# Altium schematic sheet COBConnector.SchDoc
size C; SheetNumber: 1; SheetTotal: 2
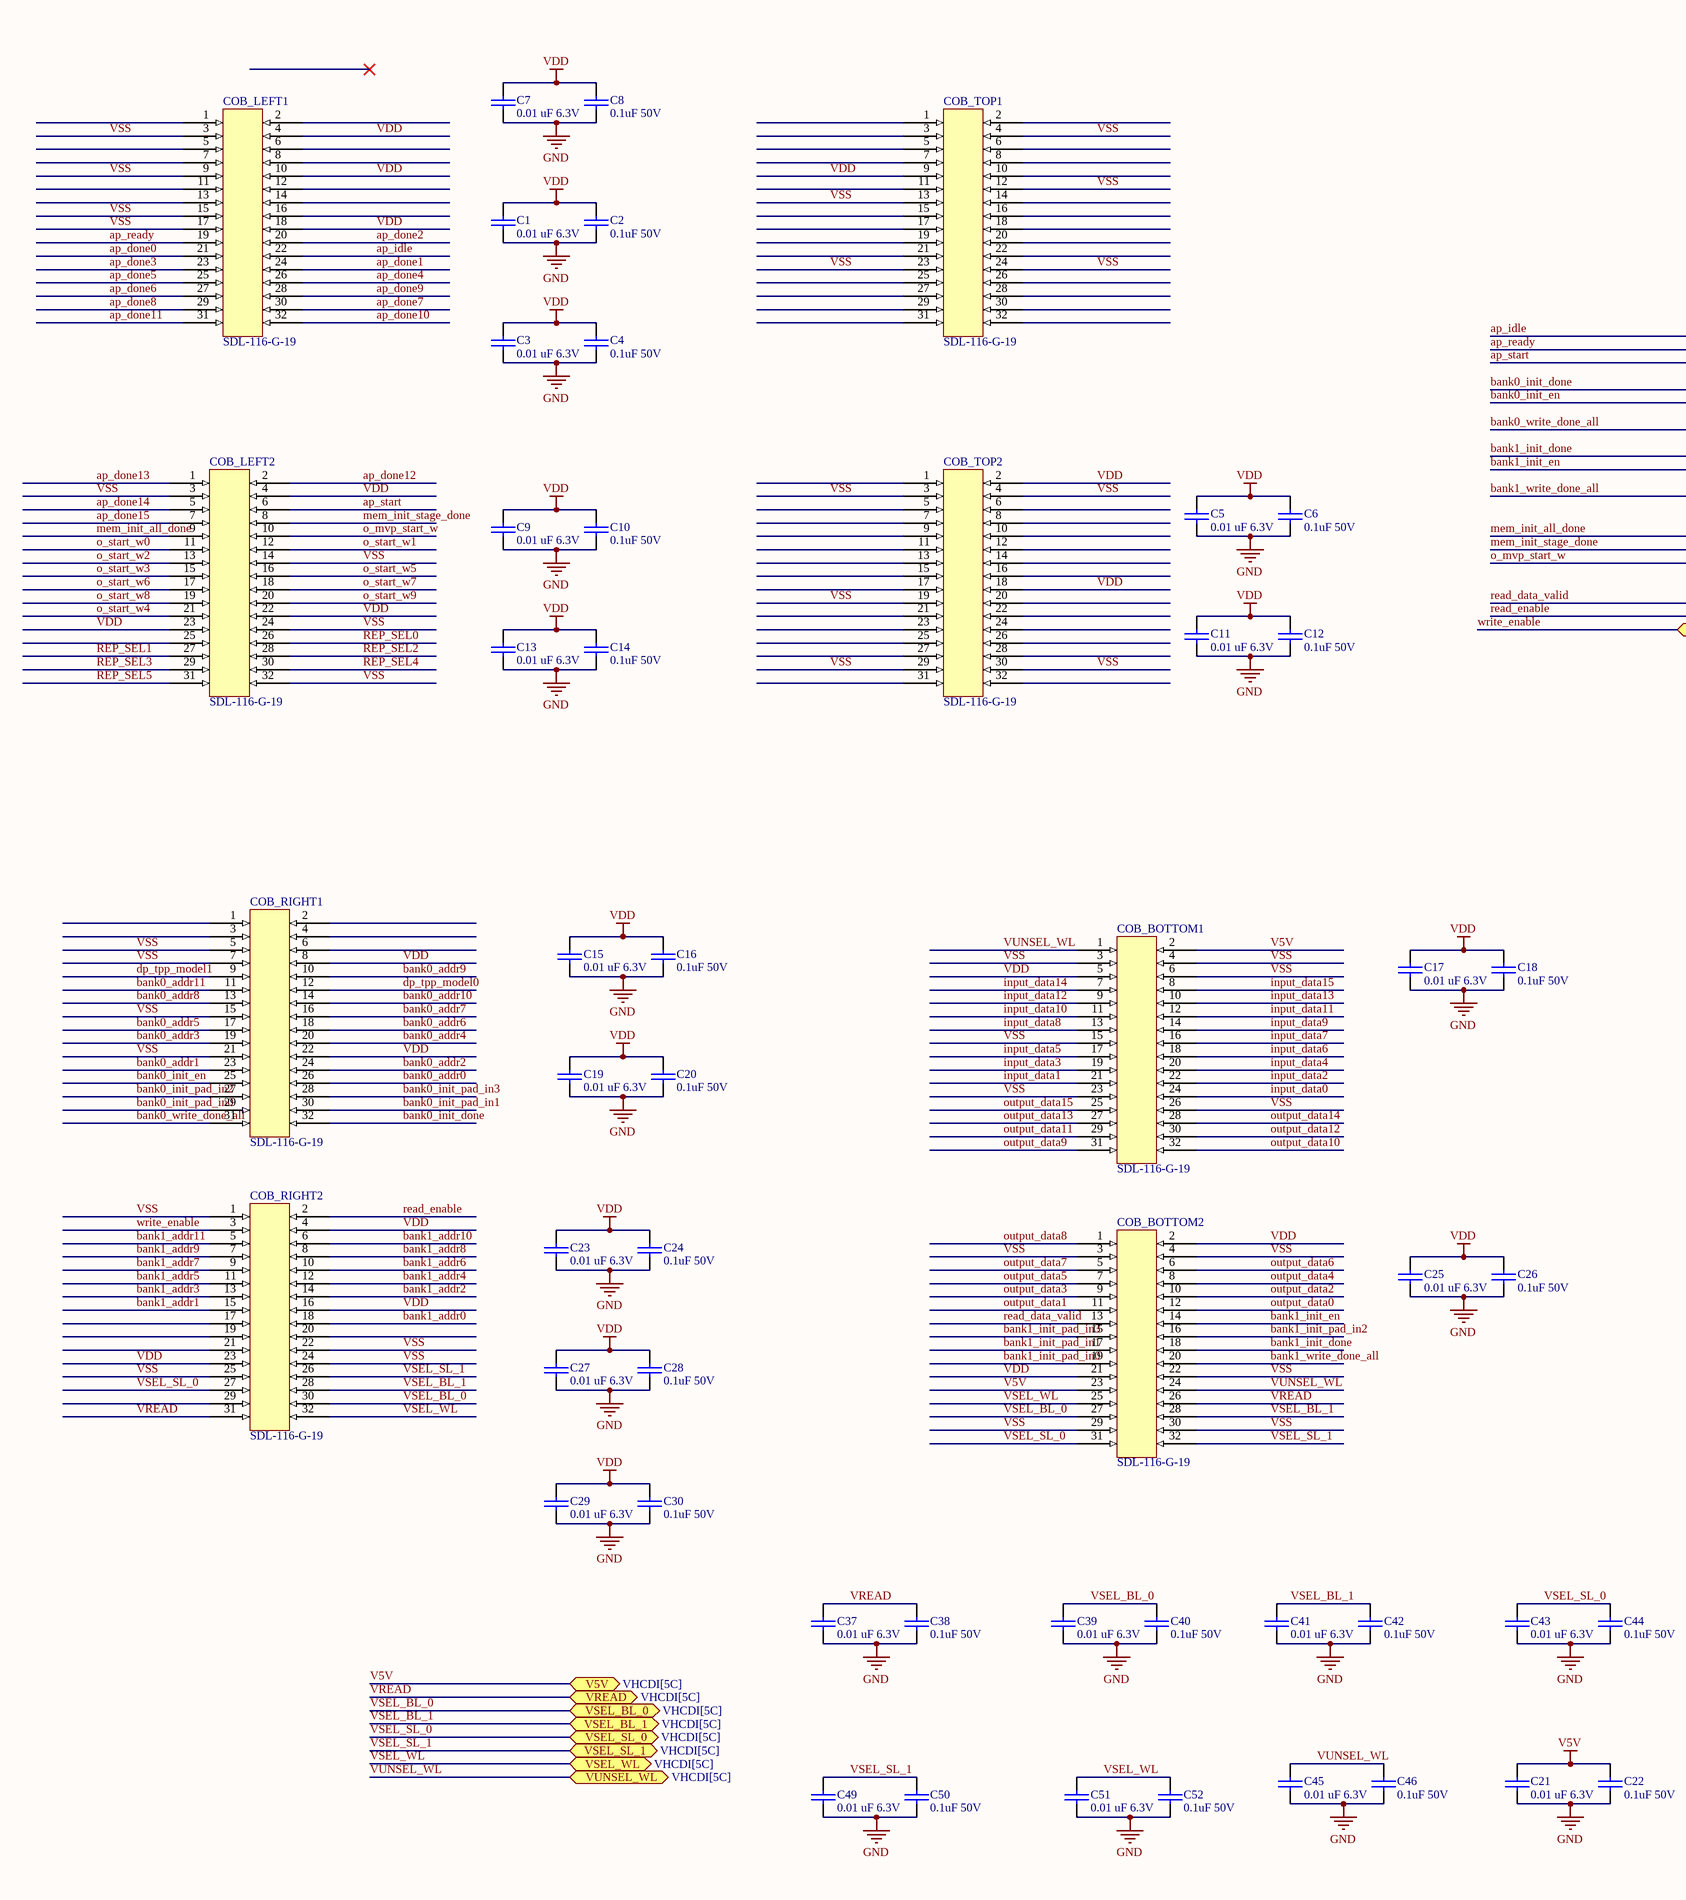
[diagram p0: COBConnector.SchDoc, left]
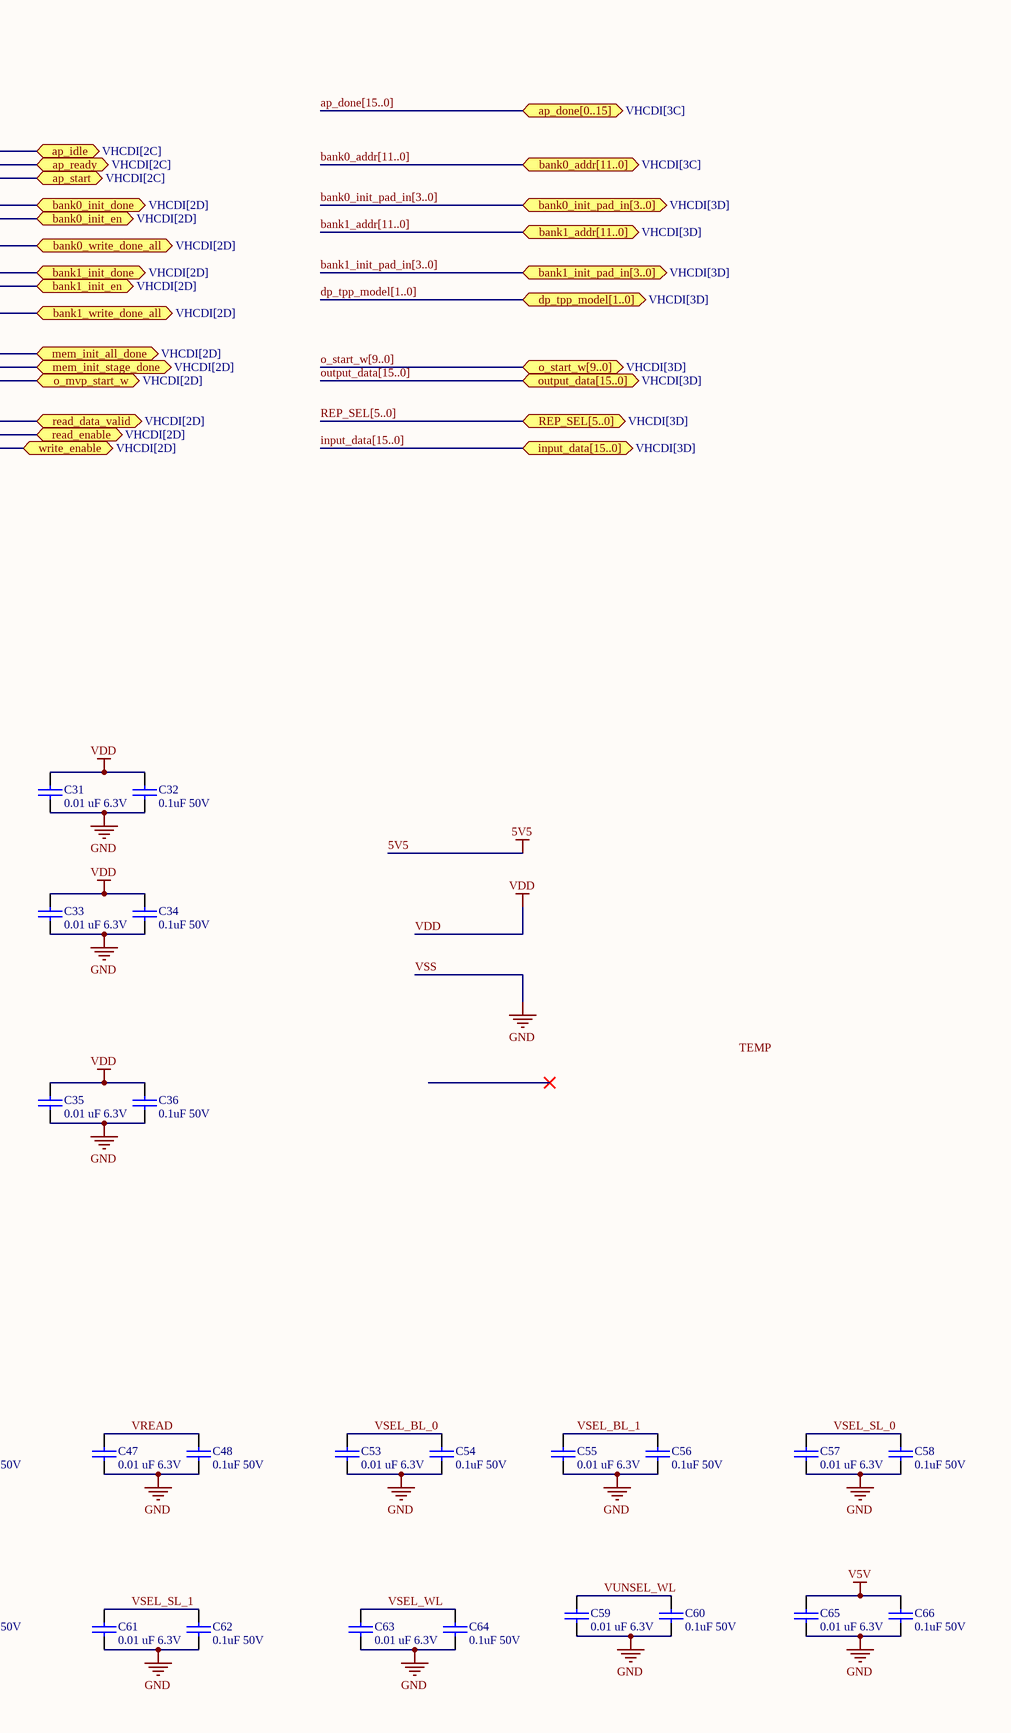
[diagram p1: COBConnector.SchDoc, right]

## Parts
C1  0.01 uF 6.3V  [C0603-XXXXXX-XXX]
C2  0.1uF 50V  [C0603-XXXXXX-XXX]
C3  0.01 uF 6.3V  [C0603-XXXXXX-XXX]
C4  0.1uF 50V  [C0603-XXXXXX-XXX]
C5  0.01 uF 6.3V  [C0603-XXXXXX-XXX]
C6  0.1uF 50V  [C0603-XXXXXX-XXX]
C7  0.01 uF 6.3V  [C0603-XXXXXX-XXX]
C8  0.1uF 50V  [C0603-XXXXXX-XXX]
C9  0.01 uF 6.3V  [C0603-XXXXXX-XXX]
C10  0.1uF 50V  [C0603-XXXXXX-XXX]
C11  0.01 uF 6.3V  [C0603-XXXXXX-XXX]
C12  0.1uF 50V  [C0603-XXXXXX-XXX]
C13  0.01 uF 6.3V  [C0603-XXXXXX-XXX]
C14  0.1uF 50V  [C0603-XXXXXX-XXX]
C15  0.01 uF 6.3V  [C0603-XXXXXX-XXX]
C16  0.1uF 50V  [C0603-XXXXXX-XXX]
C17  0.01 uF 6.3V  [C0603-XXXXXX-XXX]
C18  0.1uF 50V  [C0603-XXXXXX-XXX]
C19  0.01 uF 6.3V  [C0603-XXXXXX-XXX]
C20  0.1uF 50V  [C0603-XXXXXX-XXX]
C21  0.01 uF 6.3V  [C0603-XXXXXX-XXX]
C22  0.1uF 50V  [C0603-XXXXXX-XXX]
C23  0.01 uF 6.3V  [C0603-XXXXXX-XXX]
C24  0.1uF 50V  [C0603-XXXXXX-XXX]
C25  0.01 uF 6.3V  [C0603-XXXXXX-XXX]
C26  0.1uF 50V  [C0603-XXXXXX-XXX]
C27  0.01 uF 6.3V  [C0603-XXXXXX-XXX]
C28  0.1uF 50V  [C0603-XXXXXX-XXX]
C29  0.01 uF 6.3V  [C0603-XXXXXX-XXX]
C30  0.1uF 50V  [C0603-XXXXXX-XXX]
C31  0.01 uF 6.3V  [C0603-XXXXXX-XXX]
C32  0.1uF 50V  [C0603-XXXXXX-XXX]
C33  0.01 uF 6.3V  [C0603-XXXXXX-XXX]
C34  0.1uF 50V  [C0603-XXXXXX-XXX]
C35  0.01 uF 6.3V  [C0603-XXXXXX-XXX]
C36  0.1uF 50V  [C0603-XXXXXX-XXX]
C37  0.01 uF 6.3V  [C0603-XXXXXX-XXX]
C38  0.1uF 50V  [C0603-XXXXXX-XXX]
C39  0.01 uF 6.3V  [C0603-XXXXXX-XXX]
C40  0.1uF 50V  [C0603-XXXXXX-XXX]
C41  0.01 uF 6.3V  [C0603-XXXXXX-XXX]
C42  0.1uF 50V  [C0603-XXXXXX-XXX]
C43  0.01 uF 6.3V  [C0603-XXXXXX-XXX]
C44  0.1uF 50V  [C0603-XXXXXX-XXX]
C45  0.01 uF 6.3V  [C0603-XXXXXX-XXX]
C46  0.1uF 50V  [C0603-XXXXXX-XXX]
C47  0.01 uF 6.3V  [C0603-XXXXXX-XXX]
C48  0.1uF 50V  [C0603-XXXXXX-XXX]
C49  0.01 uF 6.3V  [C0603-XXXXXX-XXX]
C50  0.1uF 50V  [C0603-XXXXXX-XXX]
C51  0.01 uF 6.3V  [C0603-XXXXXX-XXX]
C52  0.1uF 50V  [C0603-XXXXXX-XXX]
C53  0.01 uF 6.3V  [C0603-XXXXXX-XXX]
C54  0.1uF 50V  [C0603-XXXXXX-XXX]
C55  0.01 uF 6.3V  [C0603-XXXXXX-XXX]
C56  0.1uF 50V  [C0603-XXXXXX-XXX]
C57  0.01 uF 6.3V  [C0603-XXXXXX-XXX]
C58  0.1uF 50V  [C0603-XXXXXX-XXX]
C59  0.01 uF 6.3V  [C0603-XXXXXX-XXX]
C60  0.1uF 50V  [C0603-XXXXXX-XXX]
C61  0.01 uF 6.3V  [C0603-XXXXXX-XXX]
C62  0.1uF 50V  [C0603-XXXXXX-XXX]
C63  0.01 uF 6.3V  [C0603-XXXXXX-XXX]
C64  0.1uF 50V  [C0603-XXXXXX-XXX]
C65  0.01 uF 6.3V  [C0603-XXXXXX-XXX]
C66  0.1uF 50V  [C0603-XXXXXX-XXX]
COB_BOTTOM1  SDL-116-G-19  [CON32_2X16_TU_DSL_SAI]
COB_BOTTOM2  SDL-116-G-19  [CON32_2X16_TU_DSL_SAI]
COB_LEFT1  SDL-116-G-19  [CON32_2X16_TU_DSL_SAI]
COB_LEFT2  SDL-116-G-19  [CON32_2X16_TU_DSL_SAI]
COB_RIGHT1  SDL-116-G-19  [CON32_2X16_TU_DSL_SAI]
COB_RIGHT2  SDL-116-G-19  [CON32_2X16_TU_DSL_SAI]
COB_TOP1  SDL-116-G-19  [CON32_2X16_TU_DSL_SAI]
COB_TOP2  SDL-116-G-19  [CON32_2X16_TU_DSL_SAI]

## Ports
ap_done[0..15] (bidir, see VHCDI[3C]), ap_idle (bidir, see VHCDI[2C]), ap_ready (bidir, see VHCDI[2C]), ap_start (bidir, see VHCDI[2C]), bank0_addr[11..0] (bidir, see VHCDI[3C]), bank0_init_done (bidir, see VHCDI[2D]), bank0_init_en (bidir, see VHCDI[2D]), bank0_init_pad_in[3..0] (bidir, see VHCDI[3D]), bank0_write_done_all (bidir, see VHCDI[2D]), bank1_addr[11..0] (bidir, see VHCDI[3D]), bank1_init_done (bidir, see VHCDI[2D]), bank1_init_en (bidir, see VHCDI[2D]), bank1_init_pad_in[3..0] (bidir, see VHCDI[3D]), bank1_write_done_all (bidir, see VHCDI[2D]), dp_tpp_model[1..0] (bidir, see VHCDI[3D]), input_data[15..0] (bidir, see VHCDI[3D]), mem_init_all_done (bidir, see VHCDI[2D]), mem_init_stage_done (bidir, see VHCDI[2D]), o_mvp_start_w (bidir, see VHCDI[2D]), o_start_w[9..0] (bidir, see VHCDI[3D]), output_data[15..0] (bidir, see VHCDI[3D]), read_data_valid (bidir, see VHCDI[2D]), read_enable (bidir, see VHCDI[2D]), REP_SEL[5..0] (bidir, see VHCDI[3D]), V5V (bidir, see VHCDI[5C]), VREAD (bidir, see VHCDI[5C]), VSEL_BL_0 (bidir, see VHCDI[5C]), VSEL_BL_1 (bidir, see VHCDI[5C]), VSEL_SL_0 (bidir, see VHCDI[5C]), VSEL_SL_1 (bidir, see VHCDI[5C]), VSEL_WL (bidir, see VHCDI[5C]), VUNSEL_WL (bidir, see VHCDI[5C]), write_enable (bidir, see VHCDI[2D])

## Nets
V5V: C21.1 C22.1 C65.1 C66.1 COB_BOTTOM1.2 COB_BOTTOM2.23 ; port V5V
VDD: C1.1 C2.1 C3.1 C4.1 C5.1 C6.1 C7.1 C8.1 C9.1 C10.1 C11.1 C12.1 C13.1 C14.1 C15.1 C16.1 C17.1 C18.1 C19.1 C20.1 C23.1 C24.1 C25.1 C26.1 C27.1 C28.1 C29.1 C30.1 C31.1 C32.1 C33.1 C34.1 C35.1 C36.1 COB_BOTTOM1.5 COB_BOTTOM2.2 COB_BOTTOM2.21 COB_LEFT1.4 COB_LEFT1.10 COB_LEFT1.18 COB_LEFT2.4 COB_LEFT2.22 COB_LEFT2.23 COB_RIGHT1.8 COB_RIGHT1.22 COB_RIGHT2.4 COB_RIGHT2.16 COB_RIGHT2.23 COB_TOP1.9 COB_TOP2.2 COB_TOP2.18
VSS: C1.2 C2.2 C3.2 C4.2 C5.2 C6.2 C7.2 C8.2 C9.2 C10.2 C11.2 C12.2 C13.2 C14.2 C15.2 C16.2 C17.2 C18.2 C19.2 C20.2 C21.2 C22.2 C23.2 C24.2 C25.2 C26.2 C27.2 C28.2 C29.2 C30.2 C31.2 C32.2 C33.2 C34.2 C35.2 C36.2 C37.2 C38.2 C39.2 C40.2 C41.2 C42.2 C43.2 C44.2 C45.2 C46.2 C47.2 C48.2 C49.2 C50.2 C51.2 C52.2 C53.2 C54.2 C55.2 C56.2 C57.2 C58.2 C59.2 C60.2 C61.2 C62.2 C63.2 C64.2 C65.2 C66.2 COB_BOTTOM1.3 COB_BOTTOM1.4 COB_BOTTOM1.6 COB_BOTTOM1.15 COB_BOTTOM1.23 COB_BOTTOM1.26 COB_BOTTOM2.3 COB_BOTTOM2.4 COB_BOTTOM2.22 COB_BOTTOM2.29 COB_BOTTOM2.30 COB_LEFT1.3 COB_LEFT1.9 COB_LEFT1.15 COB_LEFT1.17 COB_LEFT2.3 COB_LEFT2.14 COB_LEFT2.24 COB_LEFT2.32 COB_RIGHT1.5 COB_RIGHT1.7 COB_RIGHT1.15 COB_RIGHT1.21 COB_RIGHT2.1 COB_RIGHT2.22 COB_RIGHT2.24 COB_RIGHT2.25 COB_TOP1.4 COB_TOP1.12 COB_TOP1.13 COB_TOP1.23 COB_TOP1.24 COB_TOP2.3 COB_TOP2.4 COB_TOP2.19 COB_TOP2.29 COB_TOP2.30  [also labelled GND]
ap_done0: COB_LEFT1.21
ap_done1: COB_LEFT1.24
ap_done2: COB_LEFT1.20
ap_done3: COB_LEFT1.23
ap_done4: COB_LEFT1.26
ap_done5: COB_LEFT1.25
ap_done6: COB_LEFT1.27
ap_done7: COB_LEFT1.30
ap_done8: COB_LEFT1.29
ap_done9: COB_LEFT1.28
ap_done10: COB_LEFT1.32
ap_done11: COB_LEFT1.31
ap_done12: COB_LEFT2.2
ap_done13: COB_LEFT2.1
ap_done14: COB_LEFT2.5
ap_done15: COB_LEFT2.7
ap_idle: COB_LEFT1.22 ; port ap_idle
ap_ready: COB_LEFT1.19 ; port ap_ready
ap_start: COB_LEFT2.6 ; port ap_start
bank0_addr0: COB_RIGHT1.26
bank0_addr1: COB_RIGHT1.23
bank0_addr2: COB_RIGHT1.24
bank0_addr3: COB_RIGHT1.19
bank0_addr4: COB_RIGHT1.20
bank0_addr5: COB_RIGHT1.17
bank0_addr6: COB_RIGHT1.18
bank0_addr7: COB_RIGHT1.16
bank0_addr8: COB_RIGHT1.13
bank0_addr9: COB_RIGHT1.10
bank0_addr10: COB_RIGHT1.14
bank0_addr11: COB_RIGHT1.11
bank0_init_done: COB_RIGHT1.32 ; port bank0_init_done
bank0_init_en: COB_RIGHT1.25 ; port bank0_init_en
bank0_init_pad_in0: COB_RIGHT1.29
bank0_init_pad_in1: COB_RIGHT1.30
bank0_init_pad_in2: COB_RIGHT1.27
bank0_init_pad_in3: COB_RIGHT1.28
bank0_write_done_all: COB_RIGHT1.31 ; port bank0_write_done_all
bank1_addr0: COB_RIGHT2.18
bank1_addr1: COB_RIGHT2.15
bank1_addr2: COB_RIGHT2.14
bank1_addr3: COB_RIGHT2.13
bank1_addr4: COB_RIGHT2.12
bank1_addr5: COB_RIGHT2.11
bank1_addr6: COB_RIGHT2.10
bank1_addr7: COB_RIGHT2.9
bank1_addr8: COB_RIGHT2.8
bank1_addr9: COB_RIGHT2.7
bank1_addr10: COB_RIGHT2.6
bank1_addr11: COB_RIGHT2.5
bank1_init_done: COB_BOTTOM2.18 ; port bank1_init_done
bank1_init_en: COB_BOTTOM2.14 ; port bank1_init_en
bank1_init_pad_in0: COB_BOTTOM2.19
bank1_init_pad_in1: COB_BOTTOM2.17
bank1_init_pad_in2: COB_BOTTOM2.16
bank1_init_pad_in3: COB_BOTTOM2.15
bank1_write_done_all: COB_BOTTOM2.20 ; port bank1_write_done_all
dp_tpp_model0: COB_RIGHT1.12
dp_tpp_model1: COB_RIGHT1.9
input_data0: COB_BOTTOM1.24
input_data1: COB_BOTTOM1.21
input_data2: COB_BOTTOM1.22
input_data3: COB_BOTTOM1.19
input_data4: COB_BOTTOM1.20
input_data5: COB_BOTTOM1.17
input_data6: COB_BOTTOM1.18
input_data7: COB_BOTTOM1.16
input_data8: COB_BOTTOM1.13
input_data9: COB_BOTTOM1.14
input_data10: COB_BOTTOM1.11
input_data11: COB_BOTTOM1.12
input_data12: COB_BOTTOM1.9
input_data13: COB_BOTTOM1.10
input_data14: COB_BOTTOM1.7
input_data15: COB_BOTTOM1.8
mem_init_all_done: COB_LEFT2.9 ; port mem_init_all_done
mem_init_stage_done: COB_LEFT2.8 ; port mem_init_stage_done
o_mvp_start_w: COB_LEFT2.10 ; port o_mvp_start_w
o_start_w0: COB_LEFT2.11
o_start_w1: COB_LEFT2.12
o_start_w2: COB_LEFT2.13
o_start_w3: COB_LEFT2.15
o_start_w4: COB_LEFT2.21
o_start_w5: COB_LEFT2.16
o_start_w6: COB_LEFT2.17
o_start_w7: COB_LEFT2.18
o_start_w8: COB_LEFT2.19
o_start_w9: COB_LEFT2.20
output_data0: COB_BOTTOM2.12
output_data1: COB_BOTTOM2.11
output_data2: COB_BOTTOM2.10
output_data3: COB_BOTTOM2.9
output_data4: COB_BOTTOM2.8
output_data5: COB_BOTTOM2.7
output_data6: COB_BOTTOM2.6
output_data7: COB_BOTTOM2.5
output_data8: COB_BOTTOM2.1
output_data9: COB_BOTTOM1.31
output_data10: COB_BOTTOM1.32
output_data11: COB_BOTTOM1.29
output_data12: COB_BOTTOM1.30
output_data13: COB_BOTTOM1.27
output_data14: COB_BOTTOM1.28
output_data15: COB_BOTTOM1.25
read_data_valid: COB_BOTTOM2.13 ; port read_data_valid
read_enable: COB_RIGHT2.2 ; port read_enable
REP_SEL0: COB_LEFT2.26
REP_SEL1: COB_LEFT2.27
REP_SEL2: COB_LEFT2.28
REP_SEL3: COB_LEFT2.29
REP_SEL4: COB_LEFT2.30
REP_SEL5: COB_LEFT2.31
VREAD: C37.1 C38.1 C47.1 C48.1 COB_BOTTOM2.26 COB_RIGHT2.31 ; port VREAD
VSEL_BL_0: C39.1 C40.1 C53.1 C54.1 COB_BOTTOM2.27 COB_RIGHT2.30 ; port VSEL_BL_0
VSEL_BL_1: C41.1 C42.1 C55.1 C56.1 COB_BOTTOM2.28 COB_RIGHT2.28 ; port VSEL_BL_1
VSEL_SL_0: C43.1 C44.1 C57.1 C58.1 COB_BOTTOM2.31 COB_RIGHT2.27 ; port VSEL_SL_0
VSEL_SL_1: C49.1 C50.1 C61.1 C62.1 COB_BOTTOM2.32 COB_RIGHT2.26 ; port VSEL_SL_1
VSEL_WL: C51.1 C52.1 C63.1 C64.1 COB_BOTTOM2.25 COB_RIGHT2.32 ; port VSEL_WL
VUNSEL_WL: C45.1 C46.1 C59.1 C60.1 COB_BOTTOM1.1 COB_BOTTOM2.24 ; port VUNSEL_WL
write_enable: COB_RIGHT2.3 ; port write_enable

Not connected (* = marked no-connect by the designer): COB_LEFT1 1 2 5 6 7 8 11 12 13 14 16; COB_LEFT2 25; COB_RIGHT1 1 2 3 4 6; COB_RIGHT2 17 19 20 21 29; COB_TOP1 1 2 3 5 6 7 8 10 11 14 15 16 17 18 19 20 21 22 25 26 27 28 29 30 31 32; COB_TOP2 1 5 6 7 8 9 10 11 12 13 14 15 16 17 20 21 22 23 24 25 26 27 28 31 32

## Buses and harness runs
bus ap_done[15..0] = port ap_done[0..15]
bus bank0_addr[11..0] = port bank0_addr[11..0]
bus bank0_init_pad_in[3..0] = port bank0_init_pad_in[3..0]
bus bank1_addr[11..0] = port bank1_addr[11..0]
bus bank1_init_pad_in[3..0] = port bank1_init_pad_in[3..0]
bus dp_tpp_model[1..0] = port dp_tpp_model[1..0]
bus input_data[15..0] = port input_data[15..0]
bus o_start_w[9..0] = port o_start_w[9..0]
bus output_data[15..0] = port output_data[15..0]
bus REP_SEL[5..0] = port REP_SEL[5..0]

## Notes on the sheet
- Labels drawn without touching a wire or pin: TEMP

## Library data of the parts
C1 C3 C5 C7 C9 C11 C13 C15 C17 C19 C21 C23 C25 C27 C29 C31 C33 C35 C37 C39 C41 C43 C45 C47 C49 C51 C53 C55 C57 C59 C61 C63 C65 = C0603F103M9RACTU: Multilayer Ceramic Capacitors MLCC - SMD/SMT 6.3V 0.01uF X7R 0603 20%; Value: 0.01 uF 6.3V
C2 C4 C6 C8 C10 C12 C14 C16 C18 C20 C22 C24 C26 C28 C30 C32 C34 C36 C38 C40 C42 C44 C46 C48 C50 C52 C54 C56 C58 C60 C62 C64 C66 = C0603C104M5RAC7867: 0.1 µF ±20% 50V Ceramic Capacitor X7R 0603; KMI: 821327; Value: 0.1uF 50V